# Altium schematic sheet 24V Multiphase Buck.SchDoc
size Tabloid
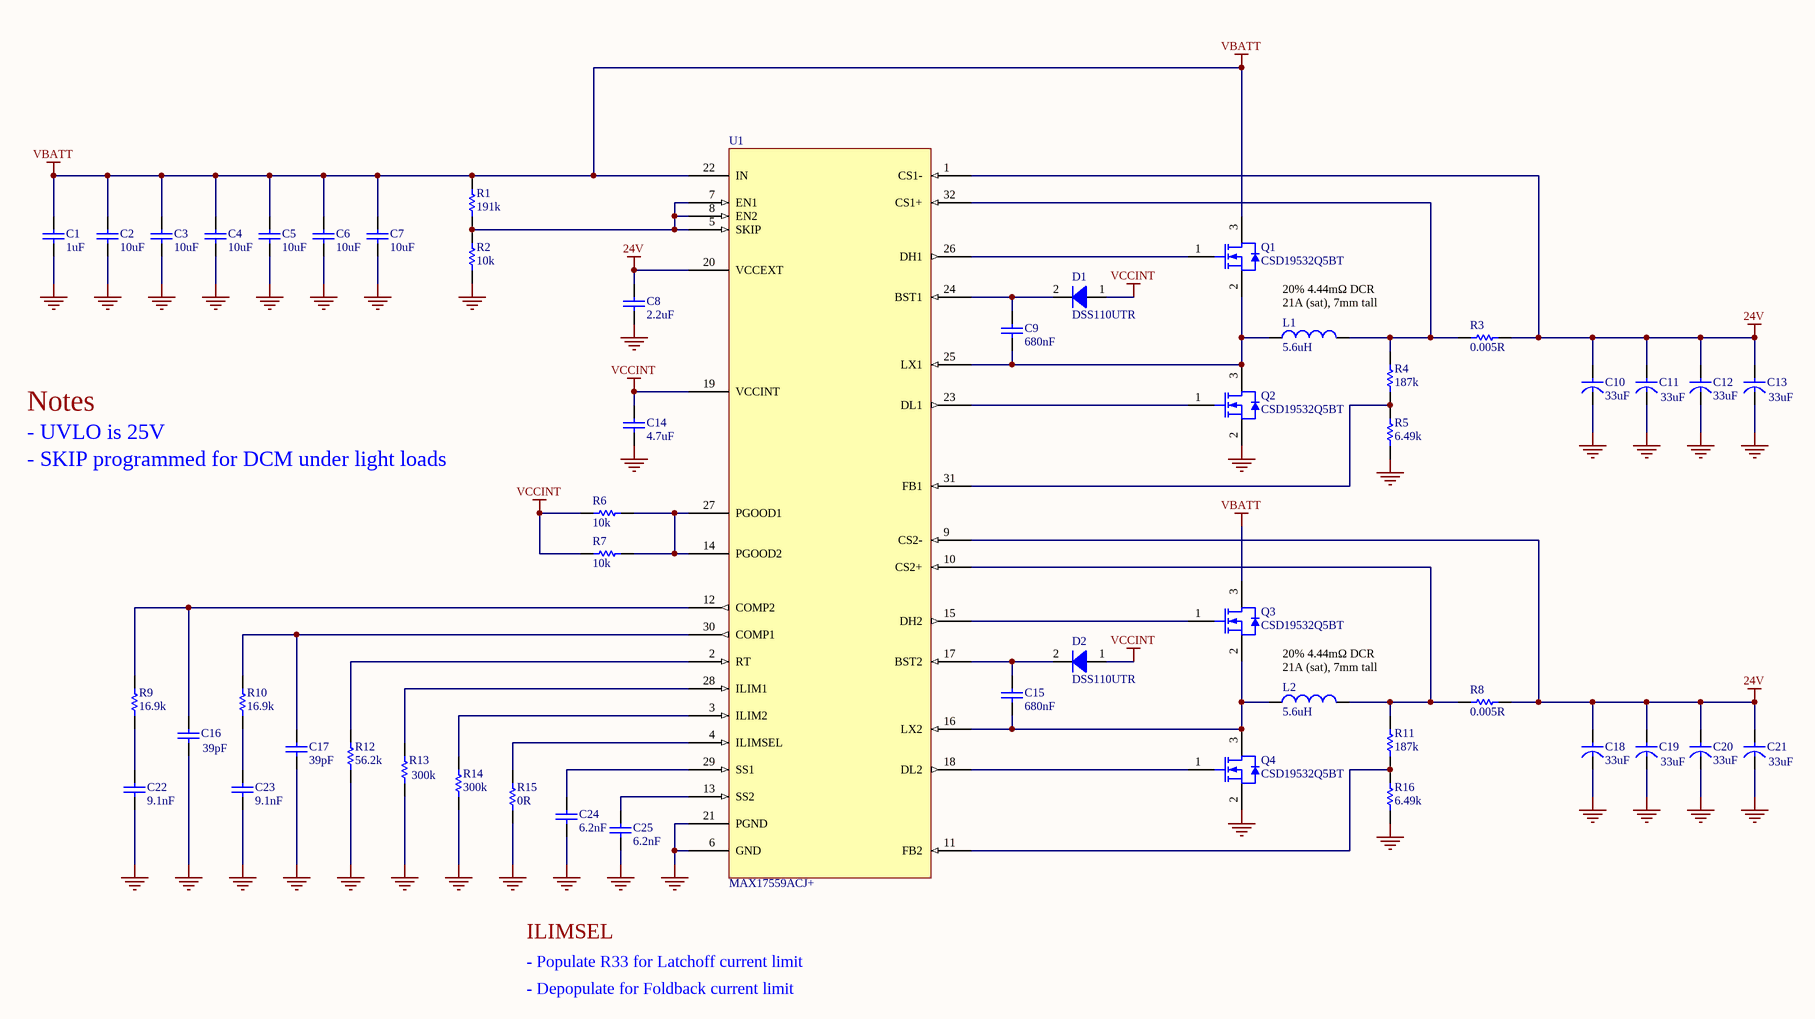
[diagram p0: 24V Multiphase Buck.SchDoc]

## Parts
C1  1uF  [C1206]
C2  10uF  [C2220]
C3  10uF  [C2220]
C4  10uF  [C2220]
C5  10uF  [C2220]
C6  10uF  [C2220]
C7  10uF  [C2220]
C8  2.2uF  [C0603]
C9  680nF  [C1206]
C10  33uF  [CAPAE9983X105M]
C11  33uF  [CAPAE9983X105M]
C12  33uF  [CAPAE9983X105M]
C13  33uF  [CAPAE9983X105M]
C14  4.7uF  [C0805]
C15  680nF  [C1206]
C16  39pF  [C0805]
C17  39pF  [C0805]
C18  33uF  [CAPAE9983X105M]
C19  33uF  [CAPAE9983X105M]
C20  33uF  [CAPAE9983X105M]
C21  33uF  [CAPAE9983X105M]
C22  9.1nF  [C0603]
C23  9.1nF  [C0603]
C24  6.2nF  [C0603]
C25  6.2nF  [C0603]
D1  DSS110UTR  [SODFL360X110-2N]
D2  DSS110UTR  [SODFL360X110-2N]
L1  5.6uH  [IHLP6767GZER5R6M11]
L2  5.6uH  [IHLP6767GZER5R6M11]
Q1  CSD19532Q5BT  [CSD19532Q5BT]
Q2  CSD19532Q5BT  [CSD19532Q5BT]
Q3  CSD19532Q5BT  [CSD19532Q5BT]
Q4  CSD19532Q5BT  [CSD19532Q5BT]
R1  191k  [RESC1005X04N]
R2  10k  [RESC1005X04N]
R3  0.005R
R4  187k  [RESC1005X04N]
R5  6.49k  [RESC1005X04N]
R6  10k  [RESC1005X04N]
R7  10k  [RESC1005X04N]
R8  0.005R
R9  16.9k  [R0805]
R10  16.9k  [R0805]
R11  187k  [RESC1005X04N]
R12  56.2k  [RESC1005X04N]
R13  300k  [RESC1005X04N]
R14  300k  [RESC1005X04N]
R15  0R  [RESC1005X04N]
R16  6.49k  [RESC1005X04N]
U1  MAX17559ACJ+

## Nets
24V: C8.2 C10.1(+) C11.1(+) C12.1(+) C13.1(+) C18.1(+) C19.1(+) C20.1(+) C21.1(+) R3.2 R8.2 U1.1(CS1-) U1.9(CS2-) U1.20(VCCEXT)
GND: C1.1 C2.1 C3.1 C4.1 C5.1 C6.1 C7.1 C8.1 C10.2(-) C11.2(-) C12.2(-) C13.2(-) C14.1 C16.1 C17.1 C18.2(-) C19.2(-) C20.2(-) C21.2(-) C22.1 C23.1 C24.1 C25.1 Q2.2(S) Q4.2(S) R2.1 R5.1 R12.1 R13.1 R14.1 R15.1 R16.1 U1.6(GND) U1.21(PGND)
VBATT: C1.2 C2.2 C3.2 C4.2 C5.2 C6.2 C7.2 Q1.3(D) Q3.3(D) R1.2 U1.22(IN)
VCCINT: C14.2 D1.1(A) D2.1(A) R6.1 R7.1 U1.19(VCCINT)
NetC9_1: C9.1 L1.1 Q1.2(S) Q2.3(D) U1.25(LX1)
NetC9_2: C9.2 D1.2(K) U1.24(BST1)
NetC15_1: C15.1 L2.1 Q3.2(S) Q4.3(D) U1.16(LX2)
NetC15_2: C15.2 D2.2(K) U1.17(BST2)
NetC16_2: C16.2 R9.2 U1.12(COMP2)
NetC17_2: C17.2 R10.2 U1.30(COMP1)
NetC22_2: C22.2 R9.1
NetC23_2: C23.2 R10.1
NetC24_2: C24.2 U1.29(SS1)
NetC25_2: C25.2 U1.13(SS2)
NetL1_2: L1.2 R3.1 R4.2 U1.32(CS1+)
NetL2_2: L2.2 R8.1 R11.2 U1.10(CS2+)
NetQ1_1: Q1.1(G) U1.26(DH1)
NetQ2_1: Q2.1(G) U1.23(DL1)
NetQ3_1: Q3.1(G) U1.15(DH2)
NetQ4_1: Q4.1(G) U1.18(DL2)
NetR1_1: R1.1 R2.2 U1.5(SKIP) U1.7(EN1) U1.8(EN2)
NetR4_1: R4.1 R5.2 U1.31(FB1)
NetR6_2: R6.2 R7.2 U1.14(PGOOD2) U1.27(PGOOD1)
NetR11_1: R11.1 R16.2 U1.11(FB2)
NetR12_2: R12.2 U1.2(RT)
NetR13_2: R13.2 U1.28(ILIM1)
NetR14_2: R14.2 U1.3(ILIM2)
NetR15_2: R15.2 U1.4(ILIMSEL)

## Notes on the sheet
- 20% 4.44mΩ DCR
- (near L1) 21A (sat), 7mm tall
- Notes
- - SKIP programmed for DCM under light loads
- - UVLO is 25V
- (near L2) 21A (sat), 7mm tall
- ILIMSEL
- - Populate R33 for Latchoff current limit
- - Depopulate for Foldback current limit

## Library data of the parts
C1 = CL31B105KCHNFNE: Cap Ceramic 1uF 100V X7R 10% SMD 1206 125°C Embossed Plastic T/R; Manufacturer: Samsung; Part Number: CL31B105KCHNFNE; Supplier 1: Digi-Key; Supplier Part Number 1: 1276-3094-1-ND; Manufacturer Part Number: CL31B105KCHNFNE; Stock 1: 65421; Pricing 1: 1=0.27000, 10=0.18500, 50=0.12360, 100=0.10510, 500=0.07418, 1000=0.06492 (USD); Mount: Surface Mount; Case/Package: 1206; Case Code (Metric): 3216; Case Code (Imperial): 1206; Min Operating Temperature: -55°C; Max Operating Temperature: 125°C; Capacitance: 1uF; Tolerance: 10%; Packaging: Cut Tape; Voltage Rating: 100V; Length: 0.126inch; Width: 0.063inch; Thickness: 0.071inch; RoHS: Yes; Category: Ceramic Capacitors; ComponentLink1URL: https://datasheet.ciiva.com/25793/cl31b105kchnfne-25793297.pdf?src-supplier=Digi-Key; Package Quantity: 1; RoHS Compliant: Yes
C2-C7 = 22201C106MAT2A: Cap Ceramic 10uF 100V X7R 20% SMD 2220 125°C Embossed T/R; Manufacturer: Kyocera AVX; Part Number: 22201C106MAT2A; Supplier 1: Digi-Key; Supplier Part Number 1: 478-9622-1-ND; Manufacturer Part Number: 22201C106MAT2A; Stock 1: 8969; Pricing 1: 1=2.06000, 10=1.66400, 50=1.45200, 100=1.27050 (USD); Mount: Surface Mount; Case/Package: 2220; Case Code (Metric): 5750; Case Code (Imperial): 2220; Min Operating Temperature: -55°C; Max Operating Temperature: 125°C; Capacitance: 10uF; Tolerance: 20%; Dielectric: X7R; Packaging: Tape and Reel; Voltage Rating: 100V; Length: 0.224inch; Width: 0.197inch; Thickness: 0.11inch; RoHS: Yes; Category: Ceramic Capacitors; Voltage Rating (DC): 100V
C8 = GRT188R61H225KE13D: 0603 2.2 uF 50 V ±10 % Tolerance X5R SMT Multilayer Ceramic Capacitor; Manufacturer: Murata; Tolerance: 10%; Voltage Rating: 50V; Part Number: GRT188R61H225KE13D; Supplier 1: Digi-Key; Supplier Part Number 1: 490-12332-1-ND; Manufacturer Part Number: GRT188R61H225KE13D; Stock 1: 38519; Pricing 1: 1=0.33000, 10=0.22900, 50=0.16000, 100=0.13720, 500=0.10292, 1000=0.08690 (USD); Mount: Surface Mount; Case/Package: 0603; Case Code (Metric): 1608; Case Code (Imperial): 0603; Min Operating Temperature: -55°C; Max Operating Temperature: 85°C; Capacitance: 2.2uF; Dielectric: X5R; Packaging: Tape and Reel; RoHS: Yes; Category: Ceramic Capacitors
C9 C15 = C1206C684K1RAC7800: Cap Cer 0.68UF 100V X7R 1206; Manufacturer: KEMET; Part Number: C1206C684K1RAC7800; Supplier 1: Digi-Key; Supplier Part Number 1: 399-15137-1-ND; Manufacturer Part Number: C1206C684K1RAC7800; Stock 1: 7801; Pricing 1: 1=0.38000, 10=0.26000, 50=0.18240, 100=0.15630, 500=0.11722, 1000=0.09898 (USD); Mount: Surface Mount; Case/Package: 1206; Min Operating Temperature: 0°C; Max Operating Temperature: 100°C; Capacitance: 680nF; RoHS: No; Category: Ceramic Capacitors
C10-C13 C18-C21 = EEV-FC1H330P: Cap 33UF 50V Elect Fc SMD; Manufacturer: Panasonic; Tolerance: 20%; Ripple Current: 225mA; Part Number: EEV-FC1H330P; Supplier 1: Digi-Key; Supplier Part Number 1: PCE3258CT-ND; Manufacturer Part Number: EEV-FC1H330P; Stock 1: 2130; Pricing 1: 1=0.69000, 10=0.42200, 50=0.30300, 100=0.26200 (USD); Mount: Surface Mount; Case/Package: Radial; Min Operating Temperature: -40°C; Max Operating Temperature: 105°C; Capacitance: 33uF; Packaging: Tape and Reel; Voltage Rating: 50V; RoHS: No; Category: Aluminum Electrolytic Capacitors; Package Quantity: 500; Termination: SMD/SMT
C14 = CL21A475KOFNNNG: 4.7µF Ceramic Capacitor 16V % Samsung Electro-Mechanics CL21A475KOFNNNG; Tolerance: 10%; Dielectric: X5R; Part Number: CL21A475KOFNNNG; Supplier 1: Digi-Key; Supplier Part Number 1: 1276-6463-6-ND; Manufacturer: Samsung; Manufacturer Part Number: CL21A475KOFNNNG; Stock 1: 16459; Pricing 1: 1=0.12, 10=0.084, 100=0.0394, 500=0.0276, 1000=0.0229 (USD); Case/Package: 0805; Case Code (Metric): 2012; Case Code (Imperial): 0805; Min Operating Temperature: -55°C; Max Operating Temperature: 85°C; Capacitance: 4.7uF; Packaging: Tape and Reel; Voltage Rating: 16V; Length: 2mm; Height: 1.25mm; Width: 0.049inch; Thickness: 0.053inch; Depth: 1.25mm; Radiation Hardening: No
C16 C17 = CL21C390JBANNNC: Ceramic capacitor SMD-0805 39pF /50V NP0# J +-5% Samsung , RoHS; Part Number: CL21C390JBANNNC; Supplier 1: Digi-Key; Supplier Part Number 1: 1276-1769-1-ND; Manufacturer: Samsung; Manufacturer Part Number: CL21C390JBANNNC; Stock 1: 206197; Pricing 1: 1=0.10000, 10=0.05100, 50=0.02780, 100=0.02270, 500=0.01622, 1000=0.01274 (USD); Mount: Surface Mount; Case/Package: 0805; Case Code (Metric): 2012; Case Code (Imperial): 0805; Capacitance: 39pF; RoHS: Yes; Category: Ceramic Capacitors
C22 C23 = C0603C912J3GACTU: Cap Ceramic 0.0091uF 25V C0G 5% Pad SMD 0603 125°C Extreme Low ESR T/R; Manufacturer: KEMET; Part Number: C0603C912J3GACTU; Supplier 1: Digi-Key; Supplier Part Number 1: 399-9982-1-ND; Manufacturer Part Number: C0603C912J3GACTU; Stock 1: 17785; Pricing 1: 1=0.54000, 10=0.37300, 50=0.26120, 100=0.22390, 500=0.16792, 1000=0.14181 (USD); Mount: Surface Mount; Case/Package: 0603; Case Code (Metric): 1608; Case Code (Imperial): 0603; Min Operating Temperature: -55°C; Max Operating Temperature: 125°C; Capacitance: 9.1nF; Tolerance: 5%; Dielectric: C0G; Packaging: Tape and Reel; Voltage Rating: 25V; RoHS: Yes; Category: Ceramic Capacitors; Dielectric Material: Ceramic; Package Quantity: 1; Termination: SMD/SMT; Voltage Rating (DC): 25V; Number of Pins: 2
C24 C25 = 06031C622JAT2A: Cap MLCC SMD 0603 100V X7R 6200pF ±5% Commercial Ti/Sn Plated 7T/R"; Manufacturer: Kyocera AVX; Part Number: 06031C622JAT2A; Supplier 1: Digi-Key; Supplier Part Number 1: 478-10228-1-ND; Manufacturer Part Number: 06031C622JAT2A; Stock 1: 53066; Pricing 1: 1=0.27000, 10=0.18600, 50=0.12420, 100=0.10560, 500=0.07452, 1000=0.06520 (USD); Mount: Surface Mount; Case/Package: 0603; Capacitance: 6.2nF; RoHS: Yes; Category: Ceramic Capacitors
D1 D2 = DSS110UTR: Schottky 100V SOD-123FL; Manufacturer: SMC; Part Number: DSS110UTR; Manufacturer Part Number: DSS110UTR; Pricing 1: 3000=0.03080, 9000=0.02570, 15000=0.02550, 60000=0.02480, 90000=0.02460 (USD); Packaging: Tape and Reel; Supplier 1: Future Electronics; Supplier Part Number 1: 6125592; RoHS: No; Category: Industrial Control; Mount: Surface Mount
L1 L2 = IHLP6767GZER5R6M11: Ind High Current Shielded Wirewound 5.6uH 20% 100KHz 28A 6767 T/R; Manufacturer: Vishay Dale; Core Material: Metal,Composite; Self Resonant Frequency: 11.8MHz; DC Resistance (DCR): 4.44mR; Max DC Current: 21A; Part Number: IHLP6767GZER5R6M11; Component Type: Inductor; ComponentLink1Description: https://datasheet.ciiva.com/1052/lp67gz11-1052676.pdf?src-supplier=Digi-Key; ComponentLink1URL: https://datasheet.ciiva.com/1052/lp67gz11-1052676.pdf?src-supplier=Digi-Key; ComponentLink2Description: https://datasheet.ciiva.com/1052/lp67gz11-1052677.pdf?src-supplier=Digi-Key; ComponentLink2URL: https://datasheet.ciiva.com/1052/lp67gz11-1052677.pdf?src-supplier=Digi-Key; Supplier 1: Digi-Key; Supplier Part Number 1: 541-1283-1-ND; Manufacturer Part Number: IHLP6767GZER5R6M11; Stock 1: 4408; Pricing 1: 1=4.62000, 10=4.23500, 25=3.85000, 50=3.23400, 100=2.77200 (USD); Case/Package: 6767; Weight: 0.000564oz; Case Code (Metric): 3225; Case Code (Imperial): 1210; Min Operating Temperature: -55°C; Max Operating Temperature: 125°C; Packaging: Tape and Reel; Tolerance: 20%; Current Rating: 28A; Shielding: Shielded; Composition: Wirewound; Inductance: 5.6uH; Test Frequency: 100kHz; Inductance Tolerance: 20%; Package Quantity: 200; Military Standard: Not; Termination: SMD/SMT; Length: 17.28mm; Height: 7mm; Width: 0.675inch; Height - Seated (Max): 0.276inch; Depth: 17.15mm; REACH SVHC: Unknown; Lead Free: Lead Free; ComponentLink3URL: https://datasheet.ciiva.com/1052/lp67gz11-1052678.pdf?src-supplier=Digi-Key; ComponentLink3Description: https://datasheet.ciiva.com/1052/lp67gz11-1052678.pdf?src-supplier=Digi-Key; Mount: Surface Mount; Contact Plating: Tin; ComponentLink4URL: https://datasheet.ciiva.com/8496/lp67gz11-8496089.pdf?src-supplier=Avnet; ComponentLink4Description: https://datasheet.ciiva.com/8496/lp67gz11-8496089.pdf?src-supplier=Avnet; ComponentLink5URL: https://datasheet.ciiva.com/8017/1852632-8017494.pdf?src-supplier=Element14; ComponentLink5Description: https://datasheet.ciiva.com/8017/1852632-8017494.pdf?src-supplier=Element14; Number of Pins: 2; RoHS Compliant: Yes; ComponentLink6URL: https://datasheet.ciiva.com/17269/lp67gz11-17269071.pdf?src-supplier=Avnet+Europe; ComponentLink6Description: https://datasheet.ciiva.com/17269/lp67gz11-17269071.pdf?src-supplier=Avnet+Europe; RoHS: Yes; Category: Fixed Inductors; Saturation Current: 21A; RMS Current (Irms): 28A; Series: IHLP-6767GZ-11; Radiation Hardening: No
Q1-Q4 = CSD19532Q5BT: MOSFET N-CH 100V 100A VSON; Manufacturer: Texas Instruments; Rise Time: 1.8ns; Rds On Max: 4.9mR; Input Capacitance: 4.81nF; Max Power Dissipation: 3.1W; Turn-On Delay Time: 2.2ns; Turn-Off Delay Time: 5.3ns; Fall Time: 5.1ns; Threshold Voltage: 1.25V; Gate to Source Voltage (Vgs): 20V; Element Configuration: Single; Number of Channels: 1; Drain to Source Breakdown Voltage: 50V; Drain to Source Resistance: 3.5R; Part Number: CSD19532Q5BT; Supplier 1: Digi-Key; Supplier Part Number 1: 296-44471-6-ND; Manufacturer Part Number: CSD19532Q5BT; Pricing 1: 1=3.21000, 10=2.88000, 100=2.31490 (USD); Mount: Surface Mount; Case/Package: SOT-23; Number of Pins: 8; Weight: 0.03g; Min Operating Temperature: -55°C; Max Operating Temperature: 150°C; Packaging: Tape and Reel; Drain to Source Voltage (Vdss): 100V; Continuous Drain Current (ID): 100A; Package Quantity: 3000; REACH SVHC: No SVHC; Stock: 8238; Pricing: 1=0.56000, 10=0.48300, 25=0.45040, 100=0.33460, 500=0.26126, 1000=0.21236 (USD); RoHS: Yes; ComponentLink1URL: http://www.ti.com/lit/ds/symlink/csd19532q5b.pdf?src-supplier=Digi-Key; Category: Integrated Circuits (ICs); Lead Free: Contains Lead; RoHS Compliant: Yes; ComponentLink1Description: http://www.ti.com/lit/ds/symlink/csd19532q5b.pdf?src-supplier=Digi-Key
R1 = RC0402FR-07191KL: Res Thick Film 0402 191K Ohm 1% 1/16W 100ppm/C Molded SMD Paper T/R; Manufacturer: Yageo; Power Rating: 62.5mW; Voltage Rating: 50V; Part Number: RC0402FR-07191KL; Supplier 1: Digi-Key; Supplier Part Number 1: YAG3022CT-ND; Manufacturer Part Number: RC0402FR-07191KL; Stock 1: 393401; Pricing 1: 1=0.10000, 10=0.01600, 100=0.00660, 1000=0.00299, 2500=0.00259, 5000=0.00214 (USD); Case/Package: 0402; Case Code (Metric): 1005; Case Code (Imperial): 0402; Min Operating Temperature: -55°C; Max Operating Temperature: 155°C; Packaging: Tape and Reel; Tolerance: 1%; Resistance: 191k; RoHS: Yes; Category: Chip SMD Resistors; Contact Plating: Tin,Lead; Resistor Type: Thick Film
R2 R6 R7 = RC0402FR-0710KL: RES SMD 10K OHM 1% 1/16W 0402; Manufacturer: Yageo; Power Rating: 62.5mW; Voltage Rating: 50V; Temperature Coefficient: 100ppm/°C; Part Number: RC0402FR-0710KL; Value: 10k; Supplier 1: Digi-Key; Supplier Part Number 1: 311-10.0KLRCT-ND; Manufacturer Part Number: RC0402FR-0710KL; Stock 1: 14034353; Pricing 1: 1=0.1, 10=0.014, 100=0.0056, 1000=0.0025, 2500=0.0022, 5000=0.0018 (USD); Case/Package: 0402; Case Code (Metric): 1005; Case Code (Imperial): 0402; Min Operating Temperature: -55°C; Max Operating Temperature: 155°C; Packaging: Tape and Reel; Tolerance: 1%; Composition: Thick Film; Resistance: 10k; Military Standard: Not; Length: 1mm; Height: 0.32mm; Width: 0.5mm; Depth: 0.5mm; Lead Pitch: 0.2mm; REACH SVHC: No SVHC; Lead Free: Lead Free
  R6 R7: ComponentLink1URL: https://datasheet.ciiva.com/7660/38568-7660787.pdf; ComponentLink1Description: https://datasheet.ciiva.com/7660/38568-7660787.pdf; ComponentLink2URL: https://datasheet.ciiva.com/7849/1784430-7849813.pdf; ComponentLink2Description: https://datasheet.ciiva.com/7849/1784430-7849813.pdf; ComponentLink3URL: https://datasheet.ciiva.com/11808/0900766b80c66297-11808309.pdf; ComponentLink3Description: https://datasheet.ciiva.com/11808/0900766b80c66297-11808309.pdf; ComponentLink4URL: https://datasheet.ciiva.com/16744/pyu-rc0402-51-rohs-l-6-r-16744005.pdf; ComponentLink4Description: https://datasheet.ciiva.com/16744/pyu-rc0402-51-rohs-l-6-r-16744005.pdf; ComponentLink5URL: https://datasheet.ciiva.com/7849/1686128-7849814.pdf; ComponentLink5Description: https://datasheet.ciiva.com/7849/1686128-7849814.pdf; ComponentLink6URL: https://datasheet.ciiva.com/7849/1784430-7849815.pdf; ComponentLink6Description: https://datasheet.ciiva.com/7849/1784430-7849815.pdf; ComponentLink7URL: https://datasheet.ciiva.com/22747/1018594-22747512.pdf; ComponentLink7Description: https://datasheet.ciiva.com/22747/1018594-22747512.pdf; ComponentLink8URL: https://datasheet.ciiva.com/12667/pyu-rc0402-51-rohs-l-6-r-12667067.pdf; ComponentLink8Description: https://datasheet.ciiva.com/12667/pyu-rc0402-51-rohs-l-6-r-12667067.pdf; ComponentLink9URL: https://datasheet.ciiva.com/7983/1018594-7983486.pdf; ComponentLink9Description: https://datasheet.ciiva.com/7983/1018594-7983486.pdf
R3 R8 = CSSH2728FT5L00: Res Metal Alloy 2728 0.005 Ohm 1% 4W ±25ppm/°C Molded SMD SMD Plastic T/R; Manufacturer: Stackpole Electronics; Part Number: CSSH2728FT5L00; Supplier 1: Digi-Key; Supplier Part Number 1: CSSH2728FT5L00CT-ND; Manufacturer Part Number: CSSH2728FT5L00; Stock 1: 21187; Pricing 1: 1=1.08000, 10=0.96100, 25=0.88360, 50=0.80600, 100=0.69750, 250=0.58900, 500=0.49600 (USD); Case/Package: 2728; Case Code (Metric): 7067; Case Code (Imperial): 2827; Min Operating Temperature: -55°C; Max Operating Temperature: 225°C; Packaging: Tape and Reel; Tolerance: 1%; Resistance: 0.005R; Power Rating: 4W; Temperature Coefficient: 25ppm/°C; Length: 0.264inch; Height: 0.049inch; Width: 0.283inch; RoHS: Yes; Category: Chip SMD Resistors; Contact Plating: Tin,Matte; Resistor Type: Metal Foil,Metal Alloy; Number of Terminations: 2; Max Power Dissipation: 4W; Mount: Surface Mount; Series: CSSH
R4 R11 = RC0402FR-07187KL: Res Thick Film 1.0 x 0.5 mm 187K Ohm 1% 0.063W(1/16W) 100ppm/ C Molded SMD Paper T/R; Manufacturer: Yageo; Power Rating: 62.5mW; Voltage Rating: 50V; Temperature Coefficient: 100ppm/°C; Part Number: RC0402FR-07187KL; Supplier 1: Digi-Key; Supplier Part Number 1: 311-187KLRCT-ND; Manufacturer Part Number: RC0402FR-07187KL; Stock 1: 381945; Pricing 1: 1=0.10000, 10=0.01600, 100=0.00660, 1000=0.00299, 2500=0.00259, 5000=0.00214 (USD); Case/Package: 0402; Case Code (Metric): 1005; Case Code (Imperial): 0402; Min Operating Temperature: -55°C; Max Operating Temperature: 155°C; Packaging: Tape and Reel; Tolerance: 1%; Package Quantity: 1; Resistance: 187k; RoHS: Yes; Category: Chip SMD Resistors; Contact Plating: Tin,Lead,Matte; Resistor Type: Thick Film; Number of Terminations: 2; Termination: SMD/SMT
R5 R16 = AC0402FR-076K49L: Chip Resistor Automotive Grade Thick Film 0402 6.49kOhm 1% Paper T/R; Manufacturer: Yageo; Power Rating: 62.5mW; Voltage Rating: 50V; Temperature Coefficient: 100ppm/°C; Max Power Dissipation: 63mW; Part Number: AC0402FR-076K49L; Supplier 1: Digi-Key; Supplier Part Number 1: 13-AC0402FR-076K49LCT-ND; Manufacturer Part Number: AC0402FR-076K49L; Stock 1: 7388; Pricing 1: 1=0.10000, 10=0.02200, 100=0.00900, 1000=0.00402, 2500=0.00349, 5000=0.00288 (USD); Case/Package: 0402; Case Code (Metric): 1005; Case Code (Imperial): 0402; Min Operating Temperature: -55°C; Max Operating Temperature: 155°C; Packaging: Tape and Reel; Tolerance: 1%; Resistance: 6.49k; RoHS: Yes; Category: Chip SMD Resistors; Resistor Type: Thick Film; Number of Terminations: 2; Termination: SMD/SMT
R9 R10 = RC0805FR-0716K9L: Res Thick Film 0805 16.9K Ohm 1% 1/8W 100ppm/C Molded SMD SMD Paper T/R; Manufacturer: Yageo; Power Rating: 125mW; Temperature Coefficient: 100ppm/°C; Voltage Rating (DC): 150V; Part Number: RC0805FR-0716K9L; Supplier 1: Digi-Key; Supplier Part Number 1: 311-16.9KCRCT-ND; Manufacturer Part Number: RC0805FR-0716K9L; Stock 1: 4730; Pricing 1: 1=0.10000, 10=0.04200, 100=0.01690, 1000=0.00759, 2500=0.00659 (USD); Case/Package: 0805; Case Code (Metric): 2012; Case Code (Imperial): 0805; Min Operating Temperature: -55°C; Max Operating Temperature: 155°C; Packaging: Tape and Reel; Tolerance: 1%; Package Quantity: 1; Resistance: 16.9k; RoHS: Yes; Category: Chip SMD Resistors; Size Code: 0805; Contact Plating: Tin,Lead,Matte; Resistor Type: Thick Film; Number of Terminations: 2; Max Power Dissipation: 125mW; Features: Moisture Resistant
R12 = RC0402FR-0756K2L: Res General Purpose Thick Film 0402 56.2K Ohm 1% 1/16W ±100ppm/°C Molded SMD Paper T/R; Manufacturer: Yageo; Power Rating: 62.5mW; Voltage Rating: 50V; Max Power Dissipation: 63mW; Part Number: RC0402FR-0756K2L; Supplier 1: Digi-Key; Supplier Part Number 1: YAG3187CT-ND; Manufacturer Part Number: RC0402FR-0756K2L; Stock 1: 6256; Pricing 1: 1=0.10000, 10=0.01600, 100=0.00660, 1000=0.00299, 2500=0.00259, 5000=0.00214 (USD); Case/Package: 0402; Case Code (Metric): 1005; Case Code (Imperial): 0402; Min Operating Temperature: -55°C; Max Operating Temperature: 155°C; Packaging: Tape and Reel; Tolerance: 1%; Resistance: 56.2k; Temperature Coefficient: 100ppm/°C; RoHS: Yes; Category: Chip SMD Resistors; Size Code: 0402; Resistor Type: Thick Film; Number of Terminations: 2; Termination: SMD/SMT
R13 R14 = RC0402FR-07300KL: YAGEO - RC0402FR-07300KL - SMD Chip Resistor, 0402 [1005 Metric], 300 kohm, RC Series, 50 V, Thick Film, 63 mW; Tolerance: 1%; Power Rating: 63mW; Voltage Rating: 50V; Part Number: RC0402FR-07300KL; Supplier 1: RSComponents; Supplier Part Number 1: 1987744; Manufacturer: Yageo; Manufacturer Part Number: RC0402FR-07300KL; Stock 1: 5400; Pricing 1: 10000=0.00300 (GBP); Case/Package: 0402; Case Code (Metric): 1005; Case Code (Imperial): 0402; Min Operating Temperature: -55°C; Max Operating Temperature: 155°C; Packaging: Tape and Reel; Resistance: 300k; RoHS: Yes; Category: Chip SMD Resistors; Size Code: 0402
R15 = RC0402FR-070RL: Thick Film Resistors - SMD 0.0ohm 1%; Manufacturer: Yageo; Power Rating: 62.5mW; Voltage Rating: 50V; Temperature Coefficient: 200ppm/°C; Part Number: RC0402FR-070RL; Value: 0R; Supplier 1: Digi-Key; Supplier Part Number 1: 311-0.0LRCT-ND; Manufacturer Part Number: RC0402FR-070RL; Stock 1: 1711107; Pricing 1: 1=0.1, 10=0.012, 25=0.0084, 50=0.0064, 100=0.0048, 250=0.0036, 500=0.0029, 1000=0.0022, 5000=0.0015 (USD); Case/Package: 0402; Case Code (Metric): 1005; Case Code (Imperial): 0402; Min Operating Temperature: -55°C; Max Operating Temperature: 155°C; Packaging: Tape and Reel; Tolerance: 1%; Composition: Thick Film; Resistance: 0R; Length: 1mm; Height: 0.35mm; Width: 0.5mm; Lead Free: Lead Free
U1 = MAX17559ACJ+: Buck Regulator Positive Output Step-Down - DC-DC Controller IC 32-TQFP (7x7)